# Altium schematic sheet 0_EPS_Interface.SchDoc
size A3
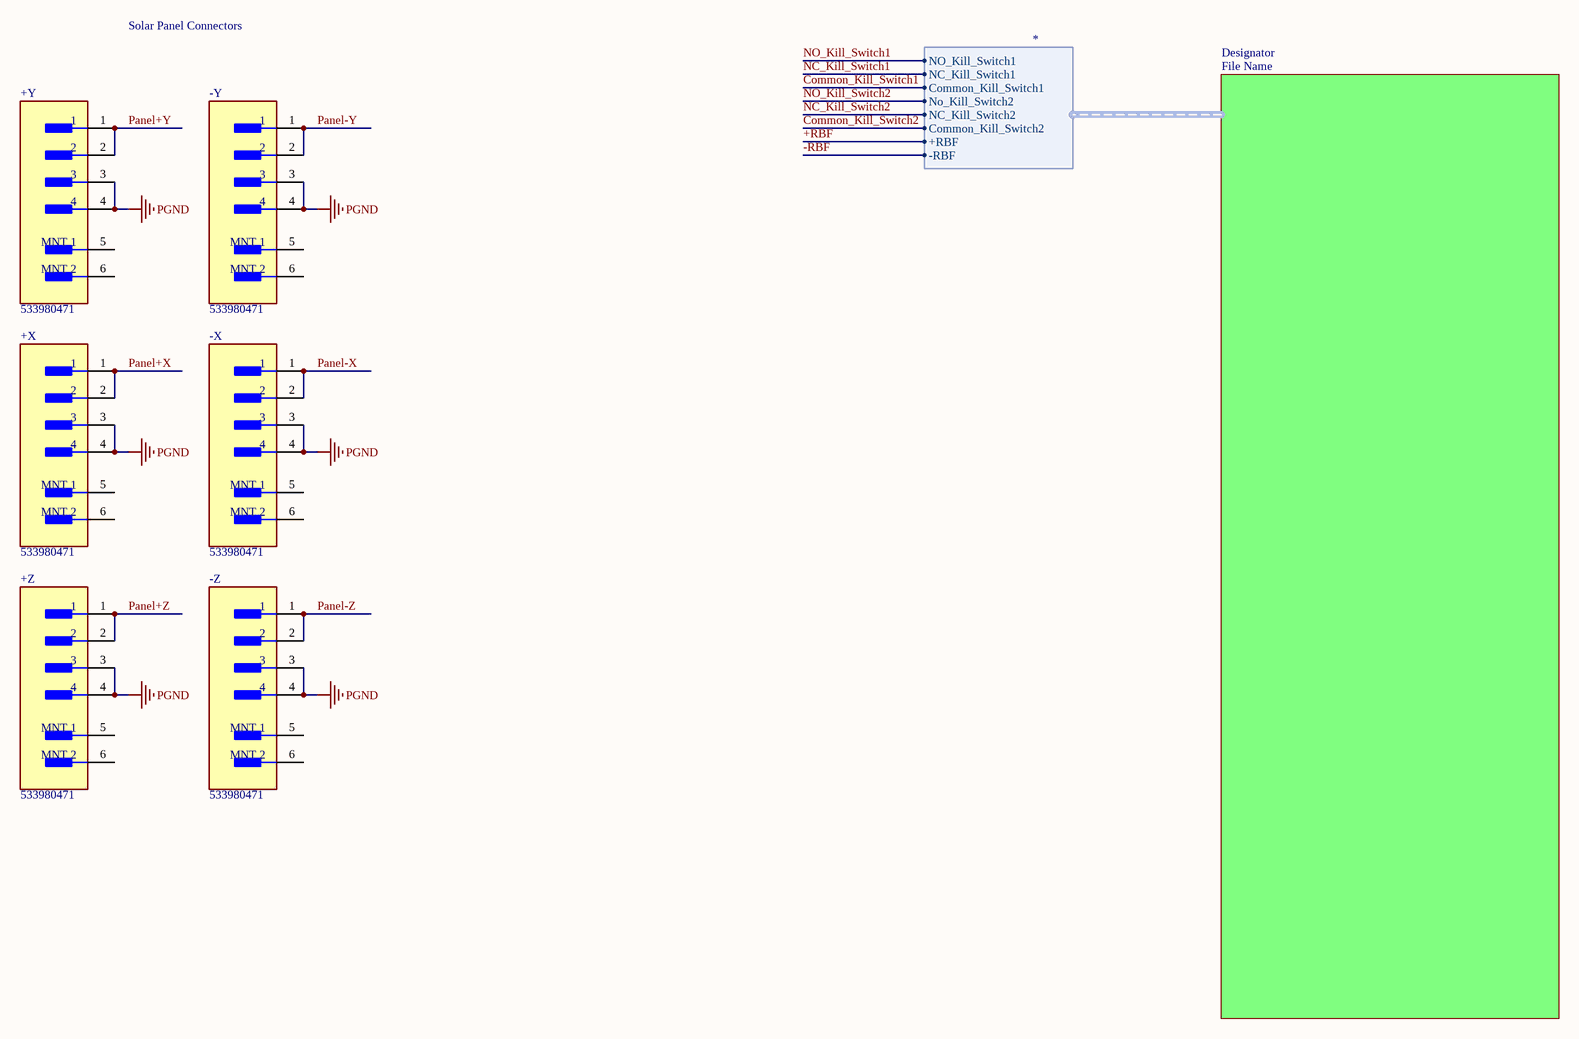
[diagram p0: 0_EPS_Interface.SchDoc]

## Parts
+X  533980471  [FP-533980471-MFG]
+Y  533980471  [FP-533980471-MFG]
+Z  533980471  [FP-533980471-MFG]
-X  533980471  [FP-533980471-MFG]
-Y  533980471  [FP-533980471-MFG]
-Z  533980471  [FP-533980471-MFG]

## Sub-sheets
Designator = File Name: no entries

## Harnesses
*: NO_Kill_Switch1, NC_Kill_Switch1, Common_Kill_Switch1, No_Kill_Switch2, NC_Kill_Switch2, Common_Kill_Switch2, +RBF, -RBF

## Nets
PGND: +X.3 +X.4 +Y.3 +Y.4 +Z.3 +Z.4 -X.3 -X.4 -Y.3 -Y.4 -Z.3 -Z.4
+RBF: harness *.+RBF
-RBF: harness *.-RBF
Common_Kill_Switch1: harness *.Common_Kill_Switch1
Common_Kill_Switch2: harness *.Common_Kill_Switch2
NC_Kill_Switch1: harness *.NC_Kill_Switch1
NC_Kill_Switch2: harness *.NC_Kill_Switch2
NO_Kill_Switch1: harness *.NO_Kill_Switch1
NO_Kill_Switch2: harness *.No_Kill_Switch2
Panel+X: +X.1 +X.2
Panel+Y: +Y.1 +Y.2
Panel+Z: +Z.1 +Z.2
Panel-X: -X.1 -X.2
Panel-Y: -Y.1 -Y.2
Panel-Z: -Z.1 -Z.2

Not connected (* = marked no-connect by the designer): +X 5(MNT_1) 6(MNT_2); +Y 5(MNT_1) 6(MNT_2); +Z 5(MNT_1) 6(MNT_2); -X 5(MNT_1) 6(MNT_2); -Y 5(MNT_1) 6(MNT_2); -Z 5(MNT_1) 6(MNT_2)

## Notes on the sheet
- Solar Panel Connectors

## Library data of the parts
+X +Y +Z -X -Y -Z = CMP-04776-000105-1: CONN HEADER SMD 4POS 1.25MM; Manufacturer: Molex; Conn Gender: Male; Description: Connector Header Surface Mount 4 position 0.049" (1.25mm); Conn Orientation: Vertical; Standoff Height: 0.05mm; Number Of Contacts: 4; Current Rating: 1A; Voltage Rating: 125V; Package: 0; ComponentLink2Description: Datasheet; ComponentLink2URL: https://www.molex.com/pdm_docs/ps/PS-51021-024-001.pdf; Ambient Temperature Range Low: -40°C; Category: Conn; Automotive: No; Number Of Rows: 1; Device Class L3: unset; Ambient Temperature Range High: +105°C; Height: 5.1mm; Lead Free: Yes; Pitch: 1.25mm; Contact Material: Tin; Footprint Url: https://www.molex.com/pdm_docs/sd/533980471_sd.pdf; Octopart: https://octopart.com/53398-0471-molex-655296; Temperature Range Low: -40°C; Device Class L2: Headers and Wire Housings; Temperature: -40°C to +105°C; Digikey Description: CONN HEADER SMD 4POS 1.25MM; RoHS: TRUE; Manufacturer Part Number: 533980471; Device Class L1: Connectors; Temperature Range High: +105°C